# Altium schematic sheet JackBot_skeem.schdoc
size 265 x 299 mm
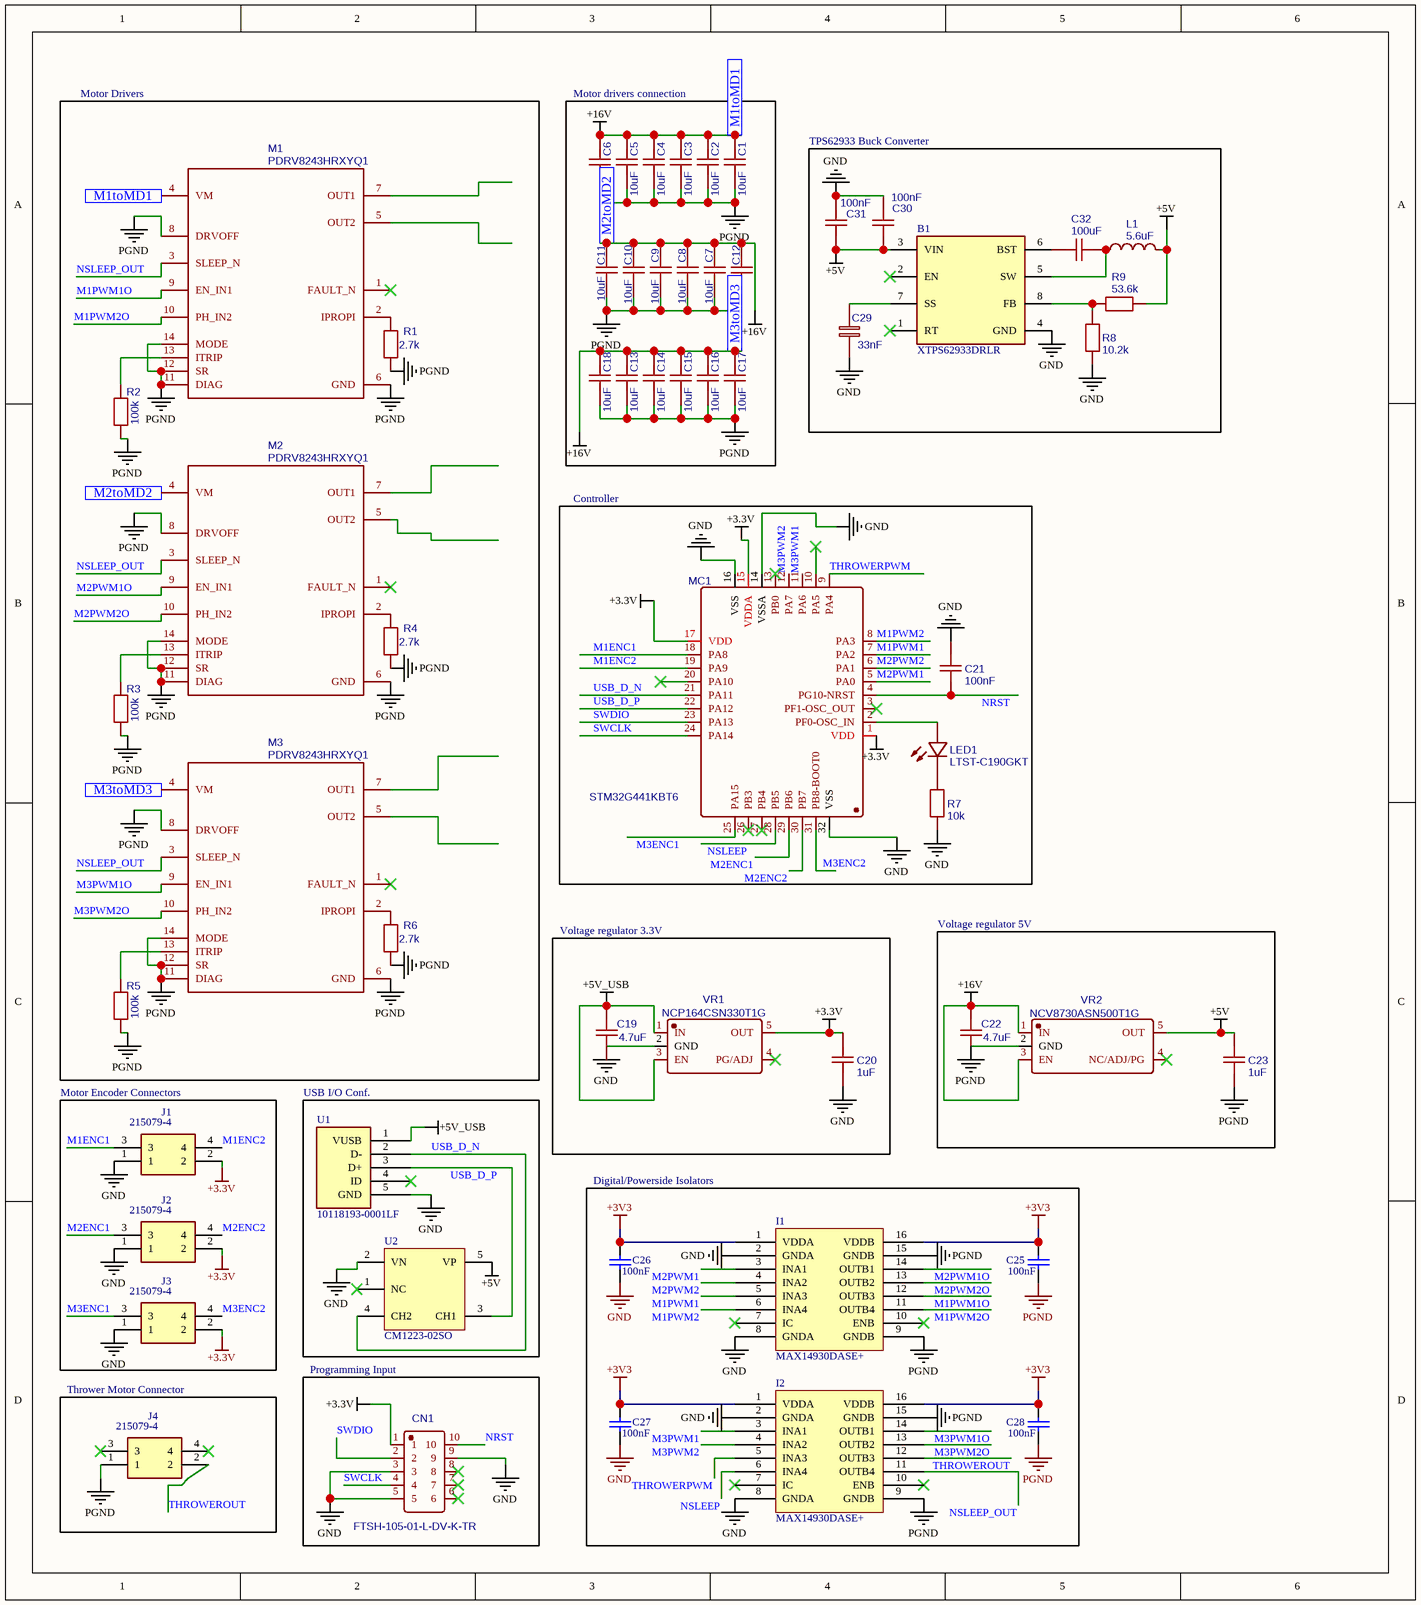
[diagram p0: JackBot_skeem.schdoc]

## Parts
B1  XTPS62933DRLR  [SOT_33DRLR_TEX]
C1  10uF  [C0603]
C2  10uF  [C0603]
C3  10uF  [C0603]
C4  10uF  [C0603]
C5  10uF  [C0603]
C6  10uF  [C0603]
C7  10uF  [C0603]
C8  10uF  [C0603]
C9  10uF  [C0603]
C10  10uF  [C0603]
C11  10uF  [C0603]
C12  10uF  [C0603]
C13  10uF  [C0603]
C14  10uF  [C0603]
C15  10uF  [C0603]
C16  10uF  [C0603]
C17  10uF  [C0603]
C18  10uF  [C0603]
C19  4.7uF  [C0603]
C20  1uF  [C0603]
C21  100nF  [C0603]
C22  4.7uF  [C0603]
C23  1uF  [C0603]
C25  100nF  [CAPC1608X90X35ML10T15]
C26  100nF  [CAPC1608X90X35ML10T15]
C27  100nF  [CAPC1608X90X35ML10T15]
C28  100nF  [CAPC1608X90X35ML10T15]
C29  33nF  [C0603]
C30  100nF  [C0603]
C31  100nF  [C0603]
C32  100uF  [C0603]
CN1  FTSH-105-01-L-DV-K-TR  [CONN-SMD_FTSH-105-01-L-DV-K-TR]
I1  MAX14930DASE+  [SOIC127P600X175-16N]
I2  MAX14930DASE+  [SOIC127P600X175-16N]
J1  215079-4  [TE_215079-4]
J2  215079-4  [TE_215079-4]
J3  215079-4  [TE_215079-4]
J4  215079-4  [TE_215079-4]
L1  5.6uF  [L0603]
LED1  LTST-C190GKT  [LED0603-RD]
M1  PDRV8243HRXYQ1  [RXY0014A-MFG]
M2  PDRV8243HRXYQ1  [RXY0014A-MFG]
M3  PDRV8243HRXYQ1  [RXY0014A-MFG]
MC1  STM32G441KBT6  [LQFP-32_L7.0-W7.0-P0.80-LS9.0-BL]
R1  2.7k  [R0603]
R2  100k  [R0603]
R3  100k  [R0603]
R4  2.7k  [R0603]
R5  100k  [R0603]
R6  2.7k  [R0603]
R7  10k  [R0603]
R8  10.2k  [R0603]
R9  53.6k  [R0603]
U1  *  [FCI_10118193-0001LF]  (value not drawn)
U2  CM1223-02SO  [SOT95P280X145-5N]
VR1  NCP164CSN330T1G  [TSOP-5_L3.0-W1.5-P0.95-LS2.8-BL]
VR2  NCV8730ASN500T1G  [TSOP-5_L3.0-W1.5-P0.95-LS2.8-BL]

## Blocks framed on the sheet
Motor Drivers: M1-M3 R1-R6
Motor drivers connection: C1-C18
TPS62933 Buck Converter: B1 C29-C32 L1 R8 R9
Controller: C21 LED1 MC1 R7
Voltage regulator 3.3V: C19 C20 VR1
Voltage regulator 5V: C22 C23 VR2
Motor Encoder Connectors: J1-J3
USB I/O Conf.: U1 U2
Digital/Powerside Isolators: C25-C28 I1 I2
Thrower Motor Connector: J4
Programming Input: CN1

## Ports
M1toMD1 (in), M2toMD2 (in), M3toMD3 (in)

## Nets
+3.3V: C20.2 CN1.1 J1.2 J2.2 J3.2 MC1.1(VDD) MC1.15(VDDA) MC1.17(VDD) VR1.5(OUT)
+3V3: C25.2 C26.2 C27.2 C28.2 I1.1(VDDA) I1.16(VDDB) I2.1(VDDA) I2.16(VDDB)
+5V: B1.3(VIN) C23.2 C30.1 C31.1 L1.2 R9.2 U2.5(VP) VR2.5(OUT)
+5V_USB: C19.2 U1.1(VUSB) VR1.1(IN) VR1.3(EN)
+16V: C1.1 C2.1 C3.1 C4.1 C5.1 C6.1 C7.1 C8.1 C9.1 C10.1 C11.1 C12.1 C13.1 C14.1 C15.1 C16.1 C17.1 C18.1 C22.2 M1.4(VM) M2.4(VM) M3.4(VM) VR2.1(IN) VR2.3(EN) ; port M1toMD1, port M2toMD2, port M3toMD3
GND: B1.4(GND) C20.1 C21.1 C26.1 C27.1 C29.1 C30.2 C31.2 CN1.3 CN1.5 CN1.9 I1.2(GNDA) I1.8(GNDA) I2.2(GNDA) I2.8(GNDA) J1.1 J2.1 J3.1 MC1.14(VSSA) MC1.16(VSS) MC1.32(VSS) R7.1 R8.1 U1.5(GND) U2.2(VN) VR1.2(GND)
PGND: C1.2 C2.2 C3.2 C4.2 C5.2 C6.2 C7.2 C8.2 C9.2 C10.2 C11.2 C12.2 C13.2 C14.2 C15.2 C16.2 C17.2 C18.2 C23.1 C25.1 C28.1 I1.9(GNDB) I1.15(GNDB) I2.9(GNDB) I2.15(GNDB) J4.1 M1.6(GND) M1.8(DRVOFF) M1.11(DIAG) M1.12(SR) M1.14(MODE) M2.6(GND) M2.8(DRVOFF) M2.11(DIAG) M2.12(SR) M2.14(MODE) M3.6(GND) M3.8(DRVOFF) M3.11(DIAG) M3.12(SR) M3.14(MODE) R1.1 R2.1 R3.1 R4.1 R5.1 R6.1 VR2.2(GND)
M1ENC1: J1.3 MC1.18(PA8)
M1ENC2: J1.4 MC1.19(PA9)
M1PWM1: I1.5(INA3) MC1.7(PA2)
M1PWM1O: I1.12(OUTB3) M1.9(EN_IN1)
M1PWM2: I1.6(INA4) MC1.8(PA3)
M1PWM2O: I1.11(OUTB4) M1.10(PH_IN2)
M2ENC1: J2.3 MC1.29(PB6)
M2ENC2: J2.4 MC1.30(PB7)
M2PWM1: I1.3(INA1) MC1.5(PA0)
M2PWM1O: I1.14(OUTB1) M2.9(EN_IN1)
M2PWM2: I1.4(INA2) MC1.6(PA1)
M2PWM2O: I1.13(OUTB2) M2.10(PH_IN2)
M3ENC1: J3.3 MC1.25(PA15)
M3ENC2: J3.4 MC1.31(PB8-BOOT0)
M3PWM1: I2.3(INA1) MC1.11(PA6)
M3PWM1O: I2.14(OUTB1) M3.9(EN_IN1)
M3PWM2: I2.4(INA2) MC1.12(PA7)
M3PWM2O: I2.13(OUTB2) M3.10(PH_IN2)
NRST: C21.2 CN1.10 MC1.4(PG10-NRST)
NSLEEP: I2.6(INA4) MC1.28(PB5)
NSLEEP_OUT: I2.11(OUTB4) M1.3(SLEEP_N) M2.3(SLEEP_N) M3.3(SLEEP_N)
SWCLK: CN1.4 MC1.24(PA14)
SWDIO: CN1.2 MC1.23(PA13)
THROWEROUT: I2.12(OUTB3) J4.2
THROWERPWM: I2.5(INA3) MC1.9(PA4)
USB_D_N: MC1.21(PA11) U1.2(D-) U2.4(CH2)
USB_D_P: MC1.22(PA12) U1.3(D+) U2.3(CH1)
NetB1_5: B1.5(SW) C32.1 L1.1
NetB1_6: B1.6(BST) C32.2
NetB1_7: B1.7(SS) C29.2
NetB1_8: B1.8(FB) R8.2 R9.1
NetLED1_1: LED1.1(-) R7.2
NetLED1_2: LED1.2(+) MC1.2(PF0-OSC_IN)
NetM1_2: M1.2(IPROPI) R1.2
NetM1_13: M1.13(ITRIP) R2.2
NetM2_2: M2.2(IPROPI) R4.2
NetM2_13: M2.13(ITRIP) R3.2
NetM3_2: M3.2(IPROPI) R6.2
NetM3_13: M3.13(ITRIP) R5.2

Not connected (* = marked no-connect by the designer): B1 1(RT)* 2(EN)*; C19 1; C22 1; CN1 6* 7* 8*; I1 7(IC)* 10(ENB)*; I2 7(IC)* 10(ENB)*; J4 3* 4*; M1 1(FAULT_N)* 5(OUT2) 7(OUT1); M2 1(FAULT_N)* 5(OUT2) 7(OUT1); M3 1(FAULT_N)* 5(OUT2) 7(OUT1); MC1 3(PF1-OSC_OUT)* 10(PA5)* 13(PB0)* 20(PA10)* 26(PB3)* 27(PB4)*; U1 4(ID)*; U2 1(NC)*; VR1 4(PG/ADJ)*; VR2 4(NC/ADJ/PG)*

## Library data of the parts
C1-C18 = 10uF: nameAlias: Value(F); Contributor: LCEDA_Lib; spicePre: C; spiceSymbolName: C_0603_US
C19 C22 = 4.7uF: nameAlias: Value(F); Contributor: LCEDA_Lib; spicePre: C; spiceSymbolName: C_0603_US
C20 C23 = 1uF: nameAlias: Value(F); Contributor: LCEDA_Lib; spicePre: C; spiceSymbolName: C_0603_US
C21 C30 C31 = 100nF: nameAlias: Value(F); Contributor: LCEDA_Lib; spicePre: C; spiceSymbolName: C_0603_US
C25-C28 = 100nF: Manufacturer: Murata; Capacitance: 22pF; Tolerance (%): ±5%; Rated Voltage: 50V; Dielectric: C0G; Manufacturer URL: http://www.murata.com/; Datasheet Version: Jul-06; Package Reference: 603; Case Size/Dimension: 0603; Package Description: 2-Pin Surface Mount Device, Body 1.6 x 0.8 mm; Datasheet URL: https://datasheet.ciiva.com/11786/0900766b807a1cab-11786398.pdf
C29 = 33nF: nameAlias: Value(F); Contributor: LCEDA_Lib; spicePre: C; spiceSymbolName: C_0603_EU
C32 = 100uF: nameAlias: Value(F); Contributor: LCEDA_Lib; spicePre: C; spiceSymbolName: C_0603_US
CN1 = FTSH-105-01-L-DV-K-TR: BOM_Manufacturer: SAMTEC; Contributor: LCSC; BOM_Supplier: LCSC; BOM_Supplier Part: C448647; BOM_Manufacturer Part: FTSH-105-01-L-DV-K-TR; BOM_JLCPCB Part Class: Extended Part; spicePre: C; spiceSymbolName: FTSH-105-01-L-DV-K-TR
J1-J4 = 215079-4: Manufacturer_Name: TE Connectivity; Datasheet Link: https://www.te.com/commerce/DocumentDelivery/DDEController?Action=srchrtrv&DocNm=215079&DocType=Customer+Drawing&DocLang=English; Height: 4.2mm; Manufacturer_Part_Number: 215079-4; Mouser Part Number: 571-215079-4; Mouser Price/Stock: https://www.mouser.co.uk/ProductDetail/TE-Connectivity/215079-4?qs=O3N86PA0UL%252BdoZEVcFx8sQ%3D%3D; Arrow Part Number: 215079-4; Arrow Price/Stock: https://www.arrow.com/en/products/215079-4/te-connectivity
L1 = 5.6uF: nameAlias: Value(H); Contributor: LCEDA_Lib; spicePre: L; spiceSymbolName: L0603_US
LED1 = LTST-C190GKT: BOM_Manufacturer: LITEON(光宝); Contributor: LCSC; BOM_Supplier: LCSC; BOM_Supplier Part: C125093; BOM_Manufacturer Part: LTST-C190GKT; BOM_JLCPCB Part Class: Extended Part; spicePre: L; spiceSymbolName: LTST-C190GKT
M1-M3 = PDRV8243HRXYQ1: Contributor: inkon; spicePre: U; spiceSymbolName: PDRV8243HRXYQ1
MC1 = STM32G441KBT6: BOM_Manufacturer: STMicroelectronics; Contributor: LCSC; Package Display: No; BOM_Supplier: LCSC; BOM_Supplier Part: C730107; BOM_Manufacturer Part: STM32G441KBT6; BOM_JLCPCB Part Class: Extended Part; spicePre: U; spiceSymbolName: STM32G441KBT6
R1 R4 R6 = 2.7k: nameAlias: Value(Ω); Contributor: LCEDA_Lib; spicePre: R; spiceSymbolName: R_0603_EU
R2 R3 R5 = 100k: nameAlias: Value(Ω); Contributor: LCEDA_Lib; spicePre: R; spiceSymbolName: R_0603_EU
R7 = 10k: nameAlias: Value(Ω); Contributor: LCEDA_Lib; spicePre: R; spiceSymbolName: R_0603_EU
R8 = 10.2k: nameAlias: Value(Ω); Contributor: LCEDA_Lib; spicePre: R; spiceSymbolName: R_0603_EU
R9 = 53.6k: nameAlias: Value(Ω); Contributor: LCEDA_Lib; spicePre: R; spiceSymbolName: R_0603_EU
U1 = *: MP: 10118193-0001LF; MF: Amphenol ICC; Availability: Unavailable; SnapEDA_Link: https://www.snapeda.com/parts/10118193-0001LF/Amphenol%20FCI/view-part/2758989/?ref=snap; Price: None
U2 = CM1223-02SO: Manufacturer: On Semiconductor; Direction: Unidirectional; PPK Max (W): 0.225; C Max (pF): 1.5; Number of Lines: 2; Packing: Tape and Reel; ComponentLink1Description: Manufacturer URL; PackageReference: SOT23-5-527AH-01; ComponentLink3URL: http://www.onsemi.com/pub_link/Collateral/527AH.PDF; ComponentLink1URL: http://www.onsemi.com/; PackageDescription: 5-Pin Small Outline Transistor, Body 2.9 x 1.6 mm, Pitch 0.95 mm; ComponentLink2URL: http://www.onsemi.com/pub_link/Collateral/CM1223-D.PDF; PackageVersion: Rev. O, 12/2008; ComponentLink3Description: Package Specification; PartNumber: CM1223-02SO; DatasheetVersion: Rev. 6; RoHS: Pb-Free; Code_JEDEC: MO-178; ComponentLink2Description: Datasheet; Mounting Technology: Surface Mount
VR1 = NCP164CSN330T1G: BOM_Manufacturer: onsemi(安森美); Contributor: LCSC; BOM_Supplier: LCSC; BOM_Supplier Part: C892220; BOM_Manufacturer Part: NCP164CSN330T1G; BOM_JLCPCB Part Class: Extended Part; spicePre: U; spiceSymbolName: NCP164CSN330T1G
VR2 = NCV8730ASN500T1G: BOM_Manufacturer: onsemi(安森美); Contributor: LCSC; BOM_Supplier: LCSC; BOM_Supplier Part: C893328; BOM_Manufacturer Part: NCV8730ASN500T1G; BOM_JLCPCB Part Class: Extended Part; spicePre: U; spiceSymbolName: NCV8730ASN500T1G